# EAGLE design 8-Bit Register State Output (EAGLE 7.5.0)
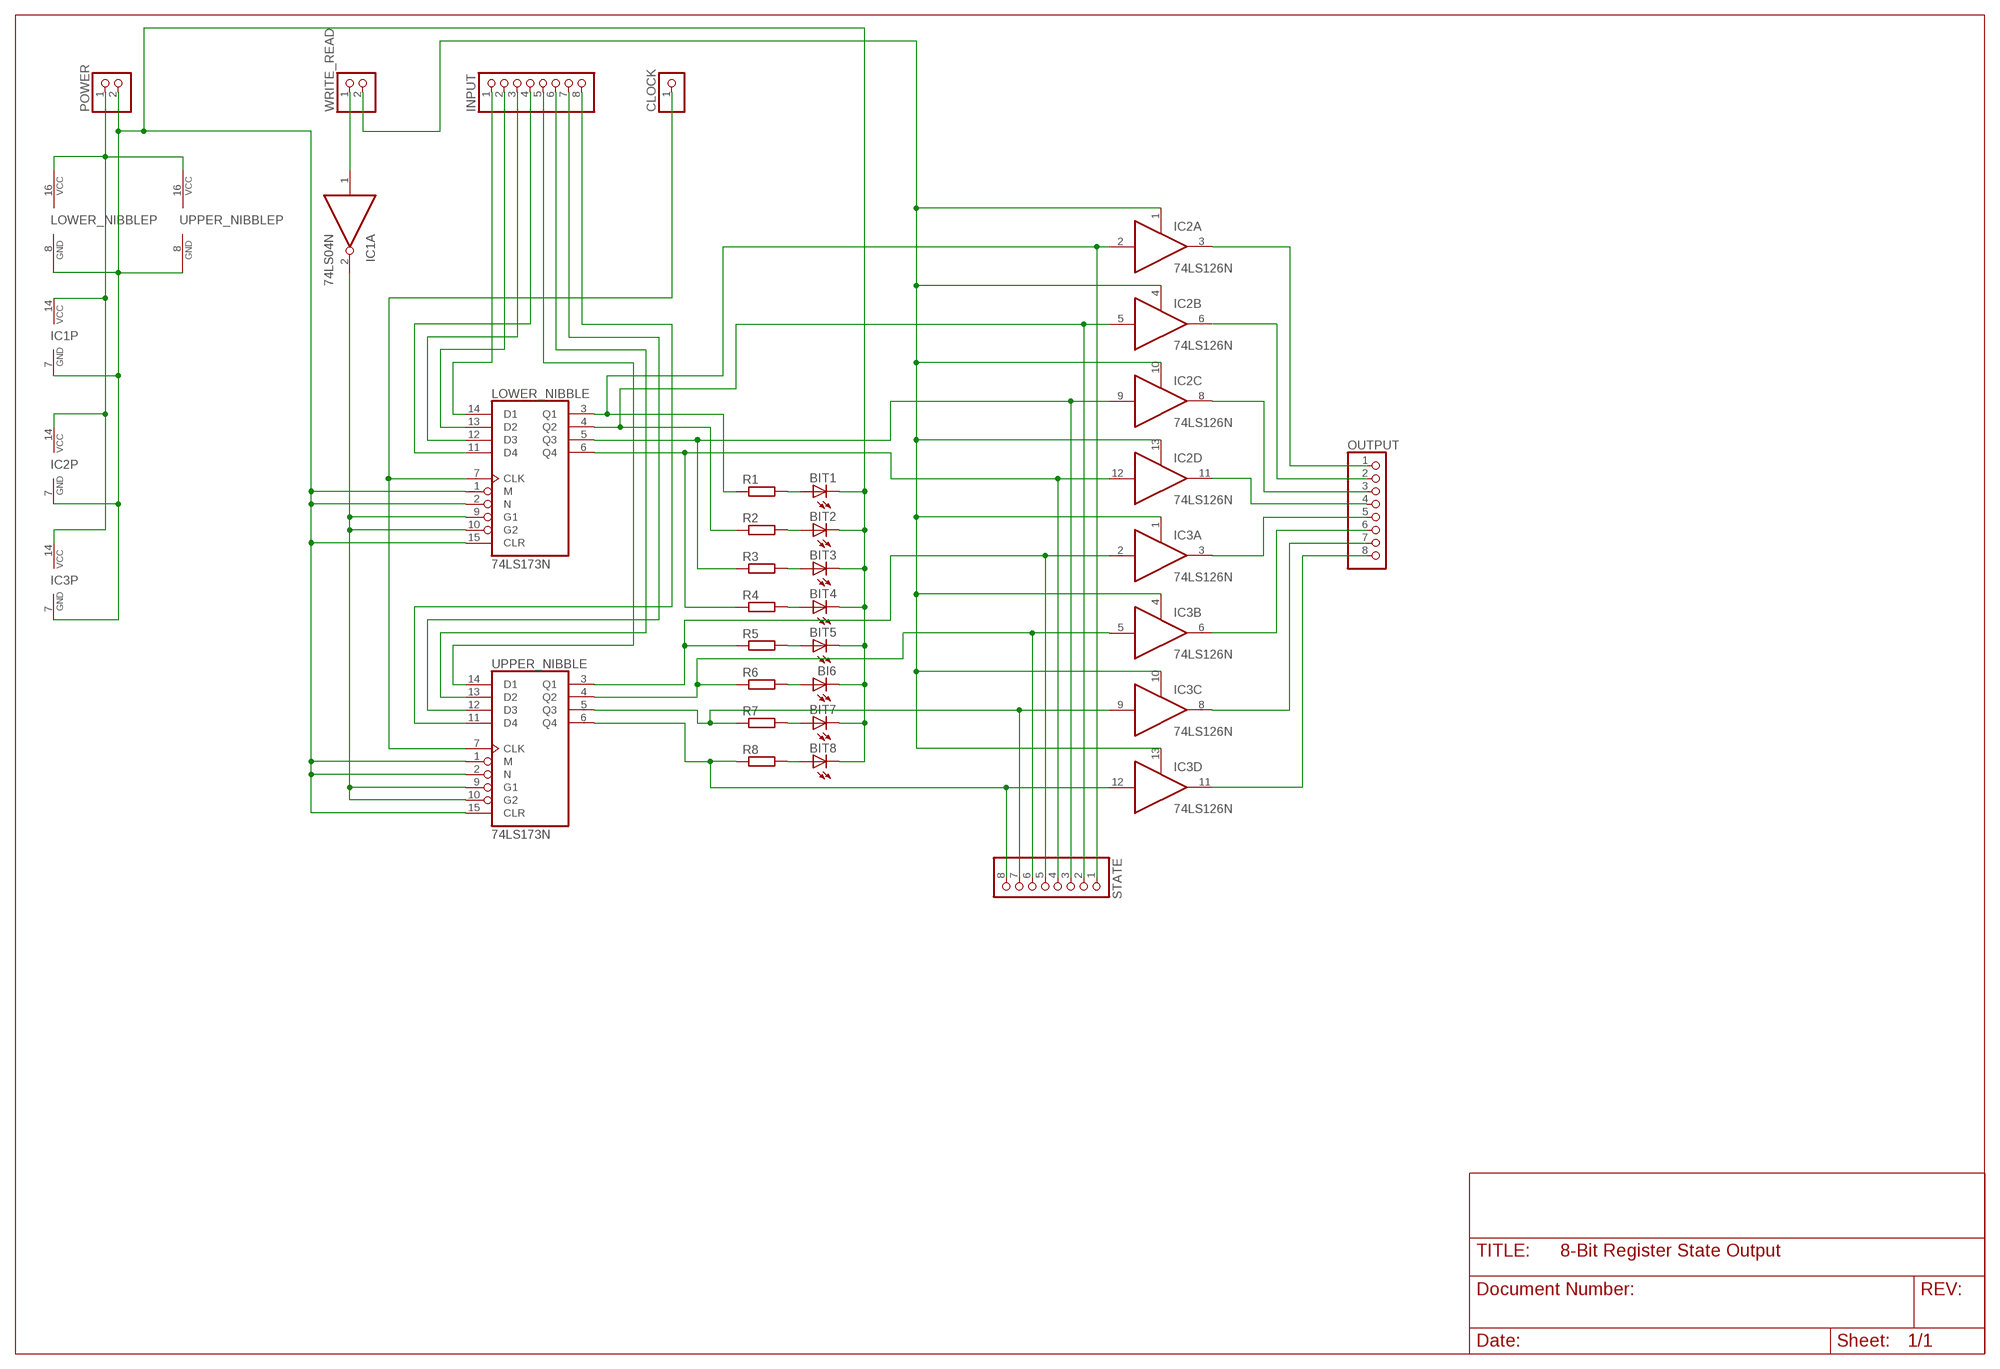
[diagram p0: schematic, sheet 1]

## Parts
BI6  LED3MM  [LED3MM]
BIT1  LED3MM  [LED3MM]
BIT2  LED3MM  [LED3MM]
BIT3  LED3MM  [LED3MM]
BIT4  LED3MM  [LED3MM]
BIT5  LED3MM  [LED3MM]
BIT7  LED3MM  [LED3MM]
BIT8  LED3MM  [LED3MM]
CLOCK  PINHD-1X1  [1X01]
IC1  74LS04N  [DIL14]
IC2  74LS126N  [DIL14]
IC3  74LS126N  [DIL14]
INPUT  PINHD-1X8  [1X08]
LOWER_NIBBLE  74LS173N  [DIL16]
OUTPUT  PINHD-1X8  [1X08]
POWER  PINHD-1X2  [1X02]
R1  R-EU_0207/10  [0207/10]
R2  R-EU_0207/10  [0207/10]
R3  R-EU_0207/10  [0207/10]
R4  R-EU_0207/10  [0207/10]
R5  R-EU_0207/10  [0207/10]
R6  R-EU_0207/10  [0207/10]
R7  R-EU_0207/10  [0207/10]
R8  R-EU_0207/10  [0207/10]
STATE  PINHD-1X8  [1X08]
UPPER_NIBBLE  74LS173N  [DIL16]
WRITE_READ  PINHD-1X2  [1X02]

## Nets
GND: BI6.K(C) BIT1.K(C) BIT2.K(C) BIT3.K(C) BIT4.K(C) BIT5.K(C) BIT7.K(C) BIT8.K(C) IC1.7(P:GND) IC2.7(P:GND) IC3.7(P:GND) LOWER_NIBBLE.1(M) LOWER_NIBBLE.2(N) LOWER_NIBBLE.8(GND) LOWER_NIBBLE.15(CLR) POWER.2 UPPER_NIBBLE.1(M) UPPER_NIBBLE.2(N) UPPER_NIBBLE.8(GND) UPPER_NIBBLE.15(CLR)
N$1: BIT8.A R8.2
N$2: IC1.1(A:I) WRITE_READ.1
N$3: BIT1.A R1.2
N$5: BIT2.A R2.2
N$6: BIT3.A R3.2
N$7: BIT4.A R4.2
N$8: BIT5.A R5.2
N$9: BI6.A R6.2
N$10: BIT7.A R7.2
N$11: IC2.11(D:O) OUTPUT.4
N$12: IC1.2(A:O) LOWER_NIBBLE.9(G1) LOWER_NIBBLE.10(G2) UPPER_NIBBLE.9(G1) UPPER_NIBBLE.10(G2)
N$13: CLOCK.1 LOWER_NIBBLE.7(CLK) UPPER_NIBBLE.7(CLK)
N$14: INPUT.1 LOWER_NIBBLE.14(D1)
N$15: INPUT.2 LOWER_NIBBLE.13(D2)
N$16: INPUT.3 LOWER_NIBBLE.12(D3)
N$17: INPUT.4 LOWER_NIBBLE.11(D4)
N$18: INPUT.6 UPPER_NIBBLE.13(D2)
N$19: INPUT.5 UPPER_NIBBLE.14(D1)
N$20: INPUT.7 UPPER_NIBBLE.12(D3)
N$21: INPUT.8 UPPER_NIBBLE.11(D4)
N$22: IC2.2(A:I) LOWER_NIBBLE.3(Q1) R1.1 STATE.1
N$23: IC2.5(B:I) LOWER_NIBBLE.4(Q2) R2.1 STATE.2
N$24: IC2.9(C:I) LOWER_NIBBLE.5(Q3) R3.1 STATE.3
N$25: IC2.12(D:I) LOWER_NIBBLE.6(Q4) R4.1 STATE.4
N$26: IC3.2(A:I) R5.1 STATE.5 UPPER_NIBBLE.3(Q1)
N$27: IC3.5(B:I) R6.1 STATE.6 UPPER_NIBBLE.4(Q2)
N$28: IC3.9(C:I) R7.1 STATE.7 UPPER_NIBBLE.5(Q3)
N$29: IC3.12(D:I) R8.1 STATE.8 UPPER_NIBBLE.6(Q4)
N$30: IC2.1(A:OE) IC2.4(B:OE) IC2.10(C:OE) IC2.13(D:OE) IC3.1(A:OE) IC3.4(B:OE) IC3.10(C:OE) IC3.13(D:OE) WRITE_READ.2
N$31: IC2.3(A:O) OUTPUT.1
N$32: IC2.6(B:O) OUTPUT.2
N$33: IC2.8(C:O) OUTPUT.3
N$35: IC3.3(A:O) OUTPUT.5
N$36: IC3.6(B:O) OUTPUT.6
N$37: IC3.8(C:O) OUTPUT.7
N$38: IC3.11(D:O) OUTPUT.8
VCC: IC1.14(P:VCC) IC2.14(P:VCC) IC3.14(P:VCC) LOWER_NIBBLE.16(VCC) POWER.1 UPPER_NIBBLE.16(VCC)
Unconnected: IC1.3(B:I) IC1.4(B:O) IC1.5(C:I) IC1.6(C:O) IC1.8(D:O) IC1.9(D:I) IC1.10(E:O) IC1.11(E:I) IC1.12(F:O) IC1.13(F:I)

## Library data of the parts
BI6 BIT1-BIT5 BIT7 BIT8 = led:LED: LED OSRAM: - CHIPLED LG R971, LG N971, LY N971, LG Q971, LY Q971, LO R971, LY R971 LH N974, LH R974 LS Q976, LO Q976, LY Q976 LO Q996 - Hyper CHIPLED LW Q18S LB Q993, LB Q99A, LB R99A - SideLED LS A670, LO A670, LY A670, LG A670, LP A670 LB A673, LV A673, LT A673, LW A673 LH A674 LY A675 LS A676, LA A676, LO A676, LY A676, LW A676 LS A679, LY A679, LG A679 - Hyper Micro SIDELED® LS Y876, LA Y876, LO Y876, LY Y876 LT Y87S - SmartLED LW L88C, LW L88S LB L89C, LB L89S, LG L890 LS L89K, LO L89K, LY L89K LS L896, LA L896, LO L896, LY L896 - TOPLED LS T670, LO T670, LY T670, LG T670, LP T670 LSG T670, LSP T670, LSY T670, LOP T670, LYG T670 LG T671, LOG T671, LSG T671 LB T673, LV T673, LT T673, LW T673 LH T674 LS T676, LA T676, LO T676, LY T676, LB T676, LH T676, LSB T676, LW T676 LB T67C, LV T67C, LT T67C, LS T67K, LO T67K, LY T67K, LW E67C LS E67B, LA E67B, LO E67B, LY E67B, LB E67C, LV E67C, LT E67C LW T67C LS T679, LY T679, LG T679 LS T770, LO T770, LY T770, LG T770, LP T770 LB T773, LV T773, LT T773, LW T773 LH T774 LS E675, LA E675, LY E675, LS T675 LS T776, LA T776, LO T776, LY T776, LB T776 LHGB T686 LT T68C, LB T68C - Hyper Mini TOPLED® LB M676 - Mini TOPLED Santana® LG M470 LS M47K, LO M47K, LY M47K Source: http://www.osram.convergy.de LUXEON: - LUMILED® LXK2-PW12-R00, LXK2-PW12-S00, LXK2-PW14-U00, LXK2-PW14-V00 LXK2-PM12-R00, LXK2-PM12-S00, LXK2-PM14-U00 LXK2-PE12-Q00, LXK2-PE12-R00, LXK2-PE12-S00, LXK2-PE14-T00, LXK2-PE14-U00 LXK2-PB12-K00, LXK2-PB12-L00, LXK2-PB12-M00, LXK2-PB14-N00, LXK2-PB14-P00, LXK2-PB14-Q00 LXK2-PR12-L00, LXK2-PR12-M00, LXK2-PR14-Q00, LXK2-PR14-R00 LXK2-PD12-Q00, LXK2-PD12-R00, LXK2-PD12-S00 LXK2-PH12-R00, LXK2-PH12-S00 LXK2-PL12-P00, LXK2-PL12-Q00, LXK2-PL12-R00 Source: www.luxeon.com KINGBRIGHT: KA-3528ASYC Source: www.kingbright.com
CLOCK = pinhead:PINHD-1X1: PIN HEADER
IC1 = 74xx-eu:74*04: Hex INVERTER
IC2 IC3 = 74xx-eu:74*126: Quad bus BUFFER, 3-state
INPUT OUTPUT STATE = pinhead:PINHD-1X8: PIN HEADER
LOWER_NIBBLE UPPER_NIBBLE = 74xx-us:74*173: 4-bit D type REGISTER, 3-state
POWER WRITE_READ = pinhead:PINHD-1X2: PIN HEADER
R1-R8 = resistor:R-EU_: RESISTOR, European symbol

## Board
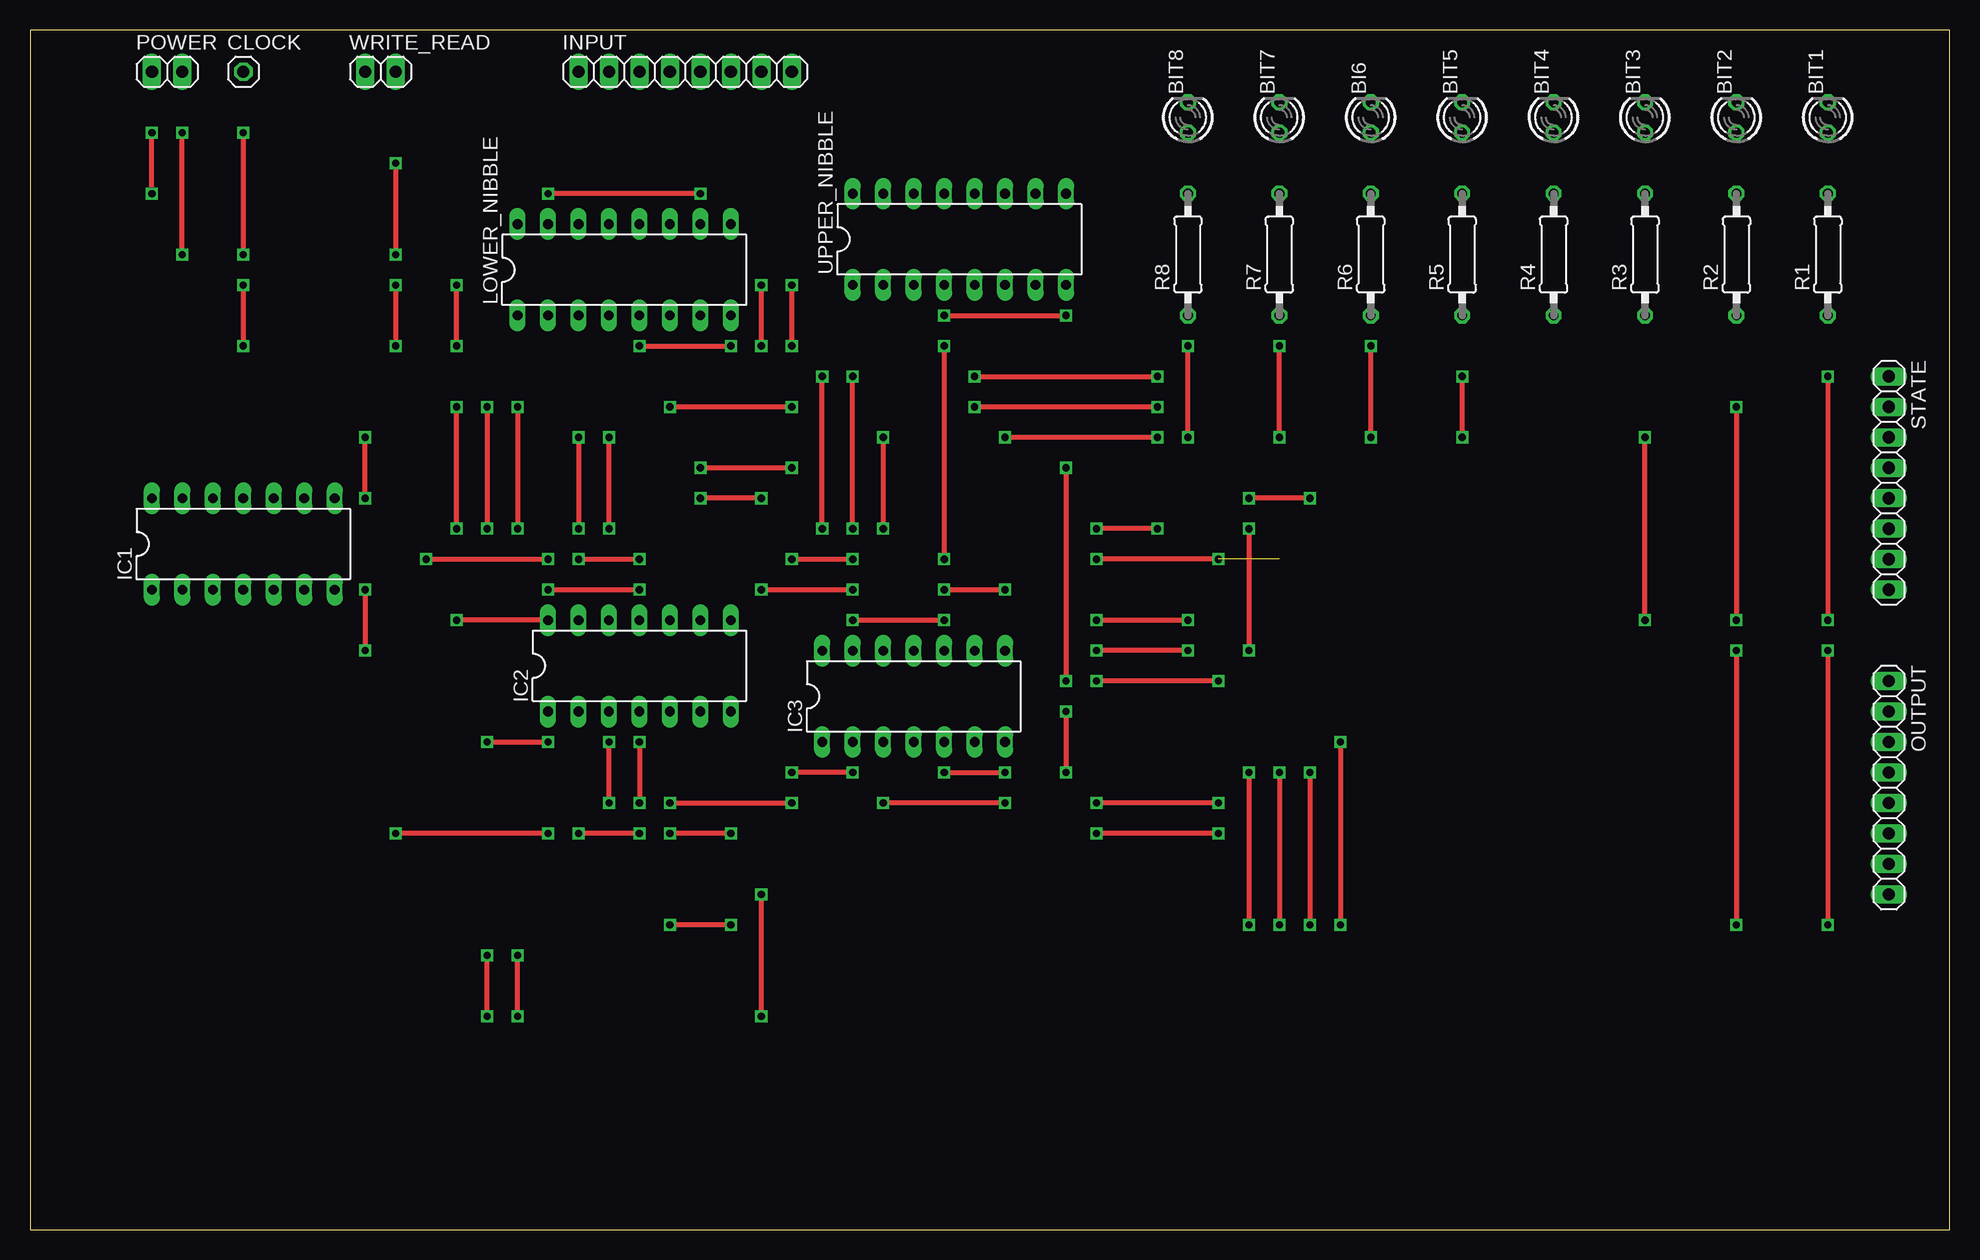
[diagram p1: board, top side]
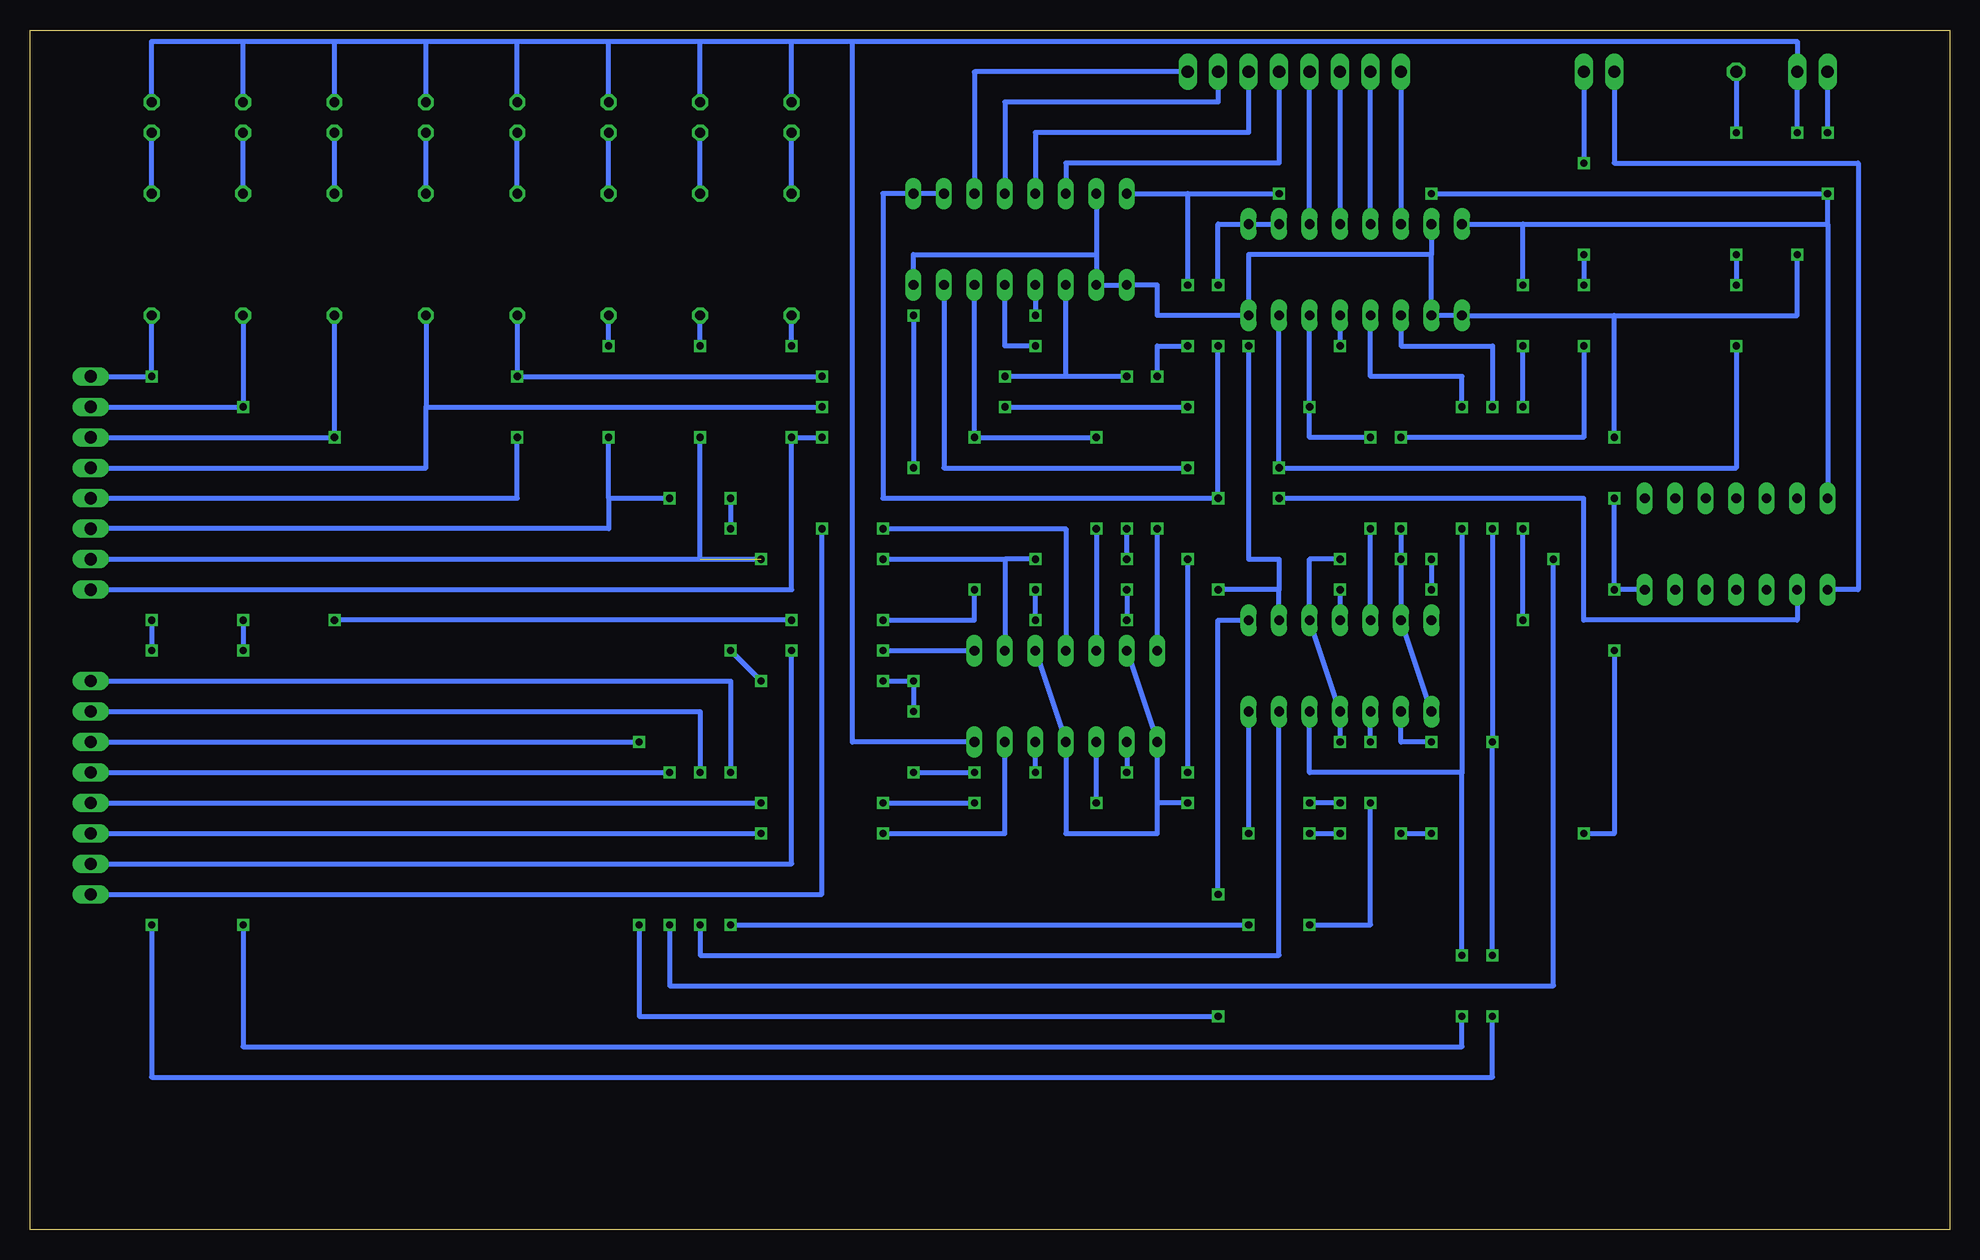
[diagram p2: board, bottom side, seen from below]

Size 160 x 100 mm. Coordinates in mm from the lower left corner, seen from the top.
Outline: 0,0 160,0 160,100 0,100 0,0
Copper layers (1*16): Top 0.035mm / dielectric 1.5mm / Bottom 0.035mm
Design rules "default": minimum track width 10mil, minimum drill 24mil, track to track 8mil, track to pad 8mil, pad to pad 8mil, via to via 8mil, smd to smd 8mil, copper to edge 40mil, drill to drill 8mil, minimum pad ring 10mil, minimum via ring 8mil, stop-mask expansion 4mil, vias tented up to drill 0mil, thermal gap 10mil

### Footprints (pad centres in the part's own frame; a part is rotated, then mirrored left to right if it is on the bottom)
LED3MM = drill 0.813 octagon: A -1.27,0; K 1.27,0
1X01 = drill 1.016 octagon: 1 0,0
DIL14 = drill 0.813 long: 1 -7.62,-3.81; 2 -5.08,-3.81; 3 -2.54,-3.81; 4 0,-3.81; 5 2.54,-3.81; 6 5.08,-3.81; 7 7.62,-3.81; 8 7.62,3.81; 9 5.08,3.81; 10 2.54,3.81; 11 0,3.81; 12 -2.54,3.81; 13 -5.08,3.81; 14 -7.62,3.81
1X08 = drill 1.016 long: 1 -8.89,0; 2 -6.35,0; 3 -3.81,0; 4 -1.27,0; 5 1.27,0; 6 3.81,0; 7 6.35,0; 8 8.89,0
DIL16 = drill 0.813 long: 1 -8.89,-3.81; 2 -6.35,-3.81; 3 -3.81,-3.81; 4 -1.27,-3.81; 5 1.27,-3.81; 6 3.81,-3.81; 7 6.35,-3.81; 8 8.89,-3.81; 9 8.89,3.81; 10 6.35,3.81; 11 3.81,3.81; 12 1.27,3.81; 13 -1.27,3.81; 14 -3.81,3.81; 15 -6.35,3.81; 16 -8.89,3.81
1X02 = drill 1.016 long: 1 -1.27,0; 2 1.27,0
0207/10 = drill 0.813 octagon: 1 -5.08,0; 2 5.08,0

### Placement (x,y rotation side)
BI6  111.76,92.71 90 top
BIT1  149.86,92.71 90 top
BIT2  142.24,92.71 90 top
BIT3  134.62,92.71 90 top
BIT4  127,92.71 90 top
BIT5  119.38,92.71 90 top
BIT7  104.14,92.71 90 top
BIT8  96.52,92.71 90 top
CLOCK  17.78,96.52 0 top
IC1  17.78,57.15 0 top
IC2  50.8,46.99 0 top
IC3  73.66,44.45 0 top
INPUT  54.61,96.52 0 top
LOWER_NIBBLE  49.53,80.01 0 top
OUTPUT  154.94,36.83 270 top
POWER  11.43,96.52 0 top
R1  149.86,81.28 90 top
R2  142.24,81.28 90 top
R3  134.62,81.28 90 top
R4  127,81.28 90 top
R5  119.38,81.28 90 top
R6  111.76,81.28 90 top
R7  104.14,81.28 90 top
R8  96.52,81.28 90 top
STATE  154.94,62.23 270 top
UPPER_NIBBLE  77.47,82.55 0 top
WRITE_READ  29.21,96.52 0 top

### Tracks (layer width: path | path; a pad name or v marks a point on that pad's centre or on a via)
GND  (via drill 0.6)
  Top 0.406: v12.7,81.28 v12.7,91.44 | v27.94,60.96 v27.94,66.04 | v58.42,33.02 v53.34,33.02 | v50.8,33.02 v45.72,33.02 | v43.18,33.02 v30.48,33.02 | v27.94,53.34 v27.94,48.26
  Bottom 0.406: BIT1.K 149.86,99.06 142.24,99.06 | 142.24,99.06 134.62,99.06 | 134.62,99.06 127,99.06 | 127,99.06 119.38,99.06 | 119.38,99.06 111.76,99.06 | 111.76,99.06 104.14,99.06 | 104.14,99.06 96.52,99.06 | BIT8.K 96.52,99.06 | BIT7.K 104.14,99.06 | BI6.K 111.76,99.06 | BIT5.K 119.38,99.06 | BIT4.K 127,99.06 | BIT3.K 134.62,99.06 | BIT2.K 142.24,99.06 | 96.52,99.06 91.44,99.06 | 91.44,99.06 12.7,99.06 POWER.2 v12.7,91.44 | LOWER_NIBBLE.15 43.18,81.28 | UPPER_NIBBLE.15 71.12,81.28 | 71.12,81.28 UPPER_NIBBLE.2 UPPER_NIBBLE.1 66.04,78.74 66.04,76.2 LOWER_NIBBLE.8 58.42,81.28 43.18,81.28 | 27.94,76.2 LOWER_NIBBLE.1 LOWER_NIBBLE.2 43.18,81.28 | 27.94,76.2 12.7,76.2 v12.7,81.28 | UPPER_NIBBLE.8 86.36,81.28 71.12,81.28 | IC1.7 v27.94,53.34 v27.94,60.96 | v27.94,66.04 27.94,76.2 | IC3.7 91.44,40.64 91.44,99.06 | IC2.7 v58.42,33.02 | v53.34,33.02 v50.8,33.02 | v45.72,33.02 v43.18,33.02 | v30.48,33.02 27.94,33.02 v27.94,48.26
N$1
  Bottom 0.406: R8.2 BIT8.A
N$2
  Bottom 0.406: WRITE_READ.1 27.94,88.9 7.62,88.9 7.62,53.34 IC1.1
N$3
  Bottom 0.406: R1.2 BIT1.A
N$5
  Bottom 0.406: R2.2 BIT2.A
N$6
  Bottom 0.406: R3.2 BIT3.A
N$7
  Bottom 0.406: R4.2 BIT4.A
N$8
  Bottom 0.406: R5.2 BIT5.A
N$9
  Bottom 0.406: R6.2 BI6.A
N$10
  Bottom 0.406: R7.2 BIT7.A
N$11  (via drill 0.6)
  Top 0.406: v106.68,38.1 v106.68,25.4 | v33.02,55.88 v43.18,55.88 | v43.18,53.34 v50.8,53.34
  Bottom 0.406: OUTPUT.4 v106.68,38.1 | v106.68,25.4 106.68,20.32 33.02,20.32 v33.02,55.88 | v43.18,55.88 v43.18,53.34 | v50.8,53.34 IC2.11
N$12  (via drill 0.6)
  Top 0.406: v60.96,73.66 v60.96,78.74 | v60.96,60.96 v55.88,60.96
  Bottom 0.406: LOWER_NIBBLE.10 LOWER_NIBBLE.9 60.96,83.82 v60.96,78.74 | UPPER_NIBBLE.10 UPPER_NIBBLE.9 88.9,86.36 88.9,60.96 v60.96,60.96 v60.96,73.66 | IC1.2 12.7,50.8 30.48,50.8 30.48,60.96 v55.88,60.96
N$13  (via drill 0.6)
  Top 0.406: v17.78,91.44 v17.78,81.28 | v17.78,78.74 v17.78,73.66 | v63.5,63.5 v55.88,63.5
  Bottom 0.406: CLOCK.1 v17.78,91.44 | v17.78,81.28 v17.78,78.74 | v17.78,73.66 17.78,63.5 v55.88,63.5 LOWER_NIBBLE.7 | UPPER_NIBBLE.7 83.82,63.5 v63.5,63.5
N$14
  Bottom 0.406: INPUT.1 LOWER_NIBBLE.14
N$15
  Bottom 0.406: LOWER_NIBBLE.13 INPUT.2
N$16
  Bottom 0.406: INPUT.3 LOWER_NIBBLE.12
N$17
  Bottom 0.406: LOWER_NIBBLE.11 INPUT.4
N$18
  Bottom 0.406: INPUT.6 58.42,91.44 76.2,91.44 UPPER_NIBBLE.13
N$19
  Bottom 0.406: INPUT.5 55.88,88.9 73.66,88.9 UPPER_NIBBLE.14
N$20
  Bottom 0.406: INPUT.7 60.96,93.98 78.74,93.98 UPPER_NIBBLE.12
N$21
  Bottom 0.406: INPUT.8 81.28,96.52 UPPER_NIBBLE.11
N$22  (via drill 0.6)
  Top 0.406: v38.1,68.58 v38.1,58.42 | v38.1,40.64 v43.18,40.64 | v149.86,71.12 v149.86,50.8 | v149.86,48.26 v149.86,25.4 | v38.1,17.78 v38.1,22.86
  Bottom 0.406: LOWER_NIBBLE.3 45.72,73.66 38.1,73.66 v38.1,68.58 | v38.1,58.42 v38.1,40.64 v38.1,22.86 | v43.18,40.64 45.72,40.64 IC2.2 | STATE.1 v149.86,71.12 R1.1 | v149.86,50.8 v149.86,48.26 | v149.86,25.4 149.86,12.7 38.1,12.7 v38.1,17.78
N$23  (via drill 0.6)
  Top 0.406: v40.64,68.58 v40.64,58.42 | v142.24,68.58 v142.24,50.8 | v142.24,48.26 v142.24,25.4 | v40.64,17.78 v40.64,22.86
  Bottom 0.406: R2.1 v142.24,68.58 STATE.2 | v40.64,58.42 40.64,38.1 | 40.64,38.1 53.34,38.1 IC2.5 | v142.24,50.8 v142.24,48.26 | v142.24,25.4 142.24,15.24 40.64,15.24 v40.64,17.78 | v40.64,22.86 40.64,38.1 | v40.64,68.58 40.64,71.12 48.26,71.12 LOWER_NIBBLE.4
N$24  (via drill 0.6)
  Top 0.406: v50.8,73.66 v58.42,73.66 | v60.96,53.34 v68.58,53.34 | v68.58,50.8 v76.2,50.8 | v76.2,53.34 v81.28,53.34 | v88.9,50.8 v96.52,50.8 | v134.62,50.8 v134.62,66.04
  Bottom 0.406: STATE.3 v134.62,66.04 R3.1 | LOWER_NIBBLE.5 v50.8,73.66 | v58.42,73.66 58.42,55.88 55.88,55.88 55.88,53.34 | IC2.9 55.88,53.34 | 55.88,53.34 v60.96,53.34 | v68.58,53.34 v68.58,50.8 | v76.2,50.8 v76.2,53.34 | v96.52,50.8 v134.62,50.8 | v88.9,50.8 81.28,50.8 v81.28,53.34
N$25  (via drill 0.6)
  Top 0.406: v48.26,58.42 v48.26,66.04 | v93.98,68.58 v78.74,68.58 | v63.5,68.58 v53.34,68.58
  Bottom 0.406: STATE.4 127,63.5 127,68.58 | IC2.12 v48.26,58.42 | v48.26,66.04 53.34,66.04 v53.34,68.58 LOWER_NIBBLE.6 | R4.1 127,68.58 | 127,68.58 v93.98,68.58 | v78.74,68.58 v63.5,68.58
N$26  (via drill 0.6)
  Top 0.406: v119.38,66.04 v119.38,71.12 | v68.58,38.1 v63.5,38.1 | v63.5,55.88 v68.58,55.88 | v68.58,58.42 v68.58,71.12 | v78.74,71.12 v93.98,71.12
  Bottom 0.406: STATE.5 119.38,60.96 v119.38,66.04 | IC3.2 v68.58,38.1 | v63.5,38.1 v63.5,55.88 | v68.58,55.88 v68.58,58.42 | v68.58,71.12 73.66,71.12 | 73.66,71.12 UPPER_NIBBLE.3 | R5.1 v119.38,71.12 v93.98,71.12 | 73.66,71.12 v78.74,71.12
N$27  (via drill 0.6)
  Top 0.406: v76.2,76.2 v86.36,76.2 | v86.36,63.5 v86.36,45.72 | v76.2,38.1 v81.28,38.1 | v86.36,43.18 v86.36,38.1 | v106.68,60.96 v101.6,60.96 | v101.6,58.42 v101.6,48.26 | v99.06,45.72 v88.9,45.72 | v111.76,66.04 v111.76,73.66
  Bottom 0.406: 111.76,60.96 111.76,58.42 STATE.6 | UPPER_NIBBLE.4 v76.2,76.2 | v86.36,76.2 v86.36,63.5 | v76.2,38.1 IC3.5 | v86.36,43.18 v86.36,45.72 v88.9,45.72 | v86.36,38.1 v81.28,38.1 | 111.76,60.96 v106.68,60.96 | v101.6,60.96 v101.6,58.42 | v99.06,45.72 v101.6,48.26 | 111.76,60.96 v111.76,66.04 | v111.76,73.66 R6.1
N$28  (via drill 0.6)  (1 unrouted)
  Top 0.406: v76.2,73.66 v76.2,55.88 | v99.06,55.88 v88.9,55.88 | v104.14,66.04 v104.14,73.66
  Bottom 0.406: STATE.7 104.14,55.88 | 104.14,55.88 v99.06,55.88 | v76.2,55.88 78.74,55.88 | 78.74,55.88 IC3.9 | v88.9,55.88 78.74,55.88 | v76.2,73.66 78.74,73.66 UPPER_NIBBLE.5 | 104.14,55.88 v104.14,66.04 | v104.14,73.66 R7.1
N$29  (via drill 0.6)
  Top 0.406: v71.12,66.04 v71.12,58.42 | v93.98,66.04 v81.28,66.04 | v96.52,66.04 v96.52,73.66
  Bottom 0.406: v71.12,66.04 v81.28,66.04 UPPER_NIBBLE.6 | v71.12,58.42 IC3.12 | STATE.8 96.52,53.34 v96.52,66.04 v93.98,66.04 | v96.52,73.66 R8.1
N$30  (via drill 0.6)
  Top 0.406: v30.48,88.9 v30.48,81.28 | v30.48,78.74 v30.48,73.66 | v45.72,66.04 v45.72,58.42 | v45.72,55.88 v50.8,55.88 | v50.8,40.64 v50.8,35.56 | v53.34,35.56 v63.5,35.56
  Bottom 0.406: WRITE_READ.2 v30.48,88.9 | v30.48,81.28 v30.48,78.74 | v30.48,73.66 30.48,66.04 v45.72,66.04 | v45.72,58.42 v45.72,55.88 IC2.13 IC2.1 | IC3.13 IC3.1 66.04,35.56 | v50.8,55.88 53.34,55.88 IC2.10 IC2.4 v50.8,40.64 | v50.8,35.56 v53.34,35.56 | v63.5,35.56 66.04,35.56 | IC3.10 IC3.4 73.66,33.02 66.04,33.02 66.04,35.56
N$31  (via drill 0.6)
  Top 0.406: v101.6,38.1 v101.6,25.4 | v58.42,25.4 v53.34,25.4 | v48.26,35.56 v48.26,40.64
  Bottom 0.406: OUTPUT.1 101.6,45.72 v101.6,38.1 | v101.6,25.4 v58.42,25.4 | v53.34,25.4 48.26,25.4 v48.26,35.56 | v48.26,40.64 IC2.3
N$32  (via drill 0.6)
  Top 0.406: v104.14,38.1 v104.14,25.4
  Bottom 0.406: OUTPUT.2 104.14,43.18 v104.14,38.1 | v104.14,25.4 104.14,22.86 55.88,22.86 IC2.6
N$33  (via drill 0.6)
  Top 0.406: v109.22,40.64 v109.22,25.4 | v60.96,17.78 v60.96,27.94
  Bottom 0.406: OUTPUT.3 v109.22,40.64 | v109.22,25.4 109.22,17.78 v60.96,17.78 | IC2.8 60.96,50.8 v60.96,27.94
N$35  (via drill 0.6)
  Top 0.406: v99.06,35.56 v88.9,35.56 | v81.28,35.56 v71.12,35.56
  Bottom 0.406: OUTPUT.5 v99.06,35.56 | v88.9,35.56 v81.28,35.56 | v71.12,35.56 IC3.3
N$36  (via drill 0.6)
  Top 0.406: v99.06,33.02 v88.9,33.02
  Bottom 0.406: OUTPUT.6 v99.06,33.02 | v88.9,33.02 78.74,33.02 IC3.6
N$37  (via drill 0.6)
  Top 0.406: v96.52,48.26 v88.9,48.26
  Bottom 0.406: OUTPUT.7 96.52,30.48 v96.52,48.26 | v88.9,48.26 IC3.8
N$38  (via drill 0.6)
  Top 0.406: v93.98,58.42 v88.9,58.42
  Bottom 0.406: OUTPUT.8 93.98,27.94 v93.98,58.42 | v88.9,58.42 73.66,58.42 IC3.11
VCC  (via drill 0.6)
  Top 0.406: v55.88,86.36 v43.18,86.36 | v10.16,86.36 v10.16,91.44 | IC2.14 v35.56,50.8 | v35.56,58.42 v35.56,68.58 | v35.56,73.66 v35.56,78.74 | v66.04,58.42 v66.04,71.12 | v63.5,73.66 v63.5,78.74
  Bottom 0.406: LOWER_NIBBLE.16 35.56,83.82 | 35.56,83.82 10.16,83.82 | UPPER_NIBBLE.16 63.5,86.36 | 63.5,86.36 v55.88,86.36 | v43.18,86.36 v10.16,86.36 10.16,83.82 | v10.16,91.44 POWER.1 | 10.16,83.82 IC1.14 | v35.56,50.8 v35.56,58.42 | v35.56,68.58 v35.56,73.66 | v35.56,78.74 35.56,83.82 | IC3.14 v66.04,58.42 | v66.04,71.12 66.04,73.66 v63.5,73.66 | v63.5,78.74 63.5,86.36
  other vias: 43.18,50.8